# Altium schematic sheet Toradex Carrier Board.SchDoc
size A3; PageSetup: Record=PageOptions|CenterHorizontal=True|CenterVertical=True|PrintScale=0.71|XCorrection=1.00|YCorrection=1.00|PrintKind=0|BorderSize=5000000|LeftOffset=0|BottomOffset=0|Orientation=2|PaperLength=1000|PaperWidth=1000|Scale=100|PaperSource=7|PrintQuality=600|MediaType=1|DitherType=10|PaperKind=A4|PrintScaleMode=1; Date: 27.05.2014; DrawnBy: luths8; Organization: BFH; Address1: Bern University of Applied Sciences; Address2: Engineering and Information Technology; Address3: Jlcoweg 1; Address4: CH-3400 Burgdorf; DocumentNumber: 18; Revision: 1.0; SheetNumber: 5; SheetTotal: 19; CurrentDate: 27.05.2014
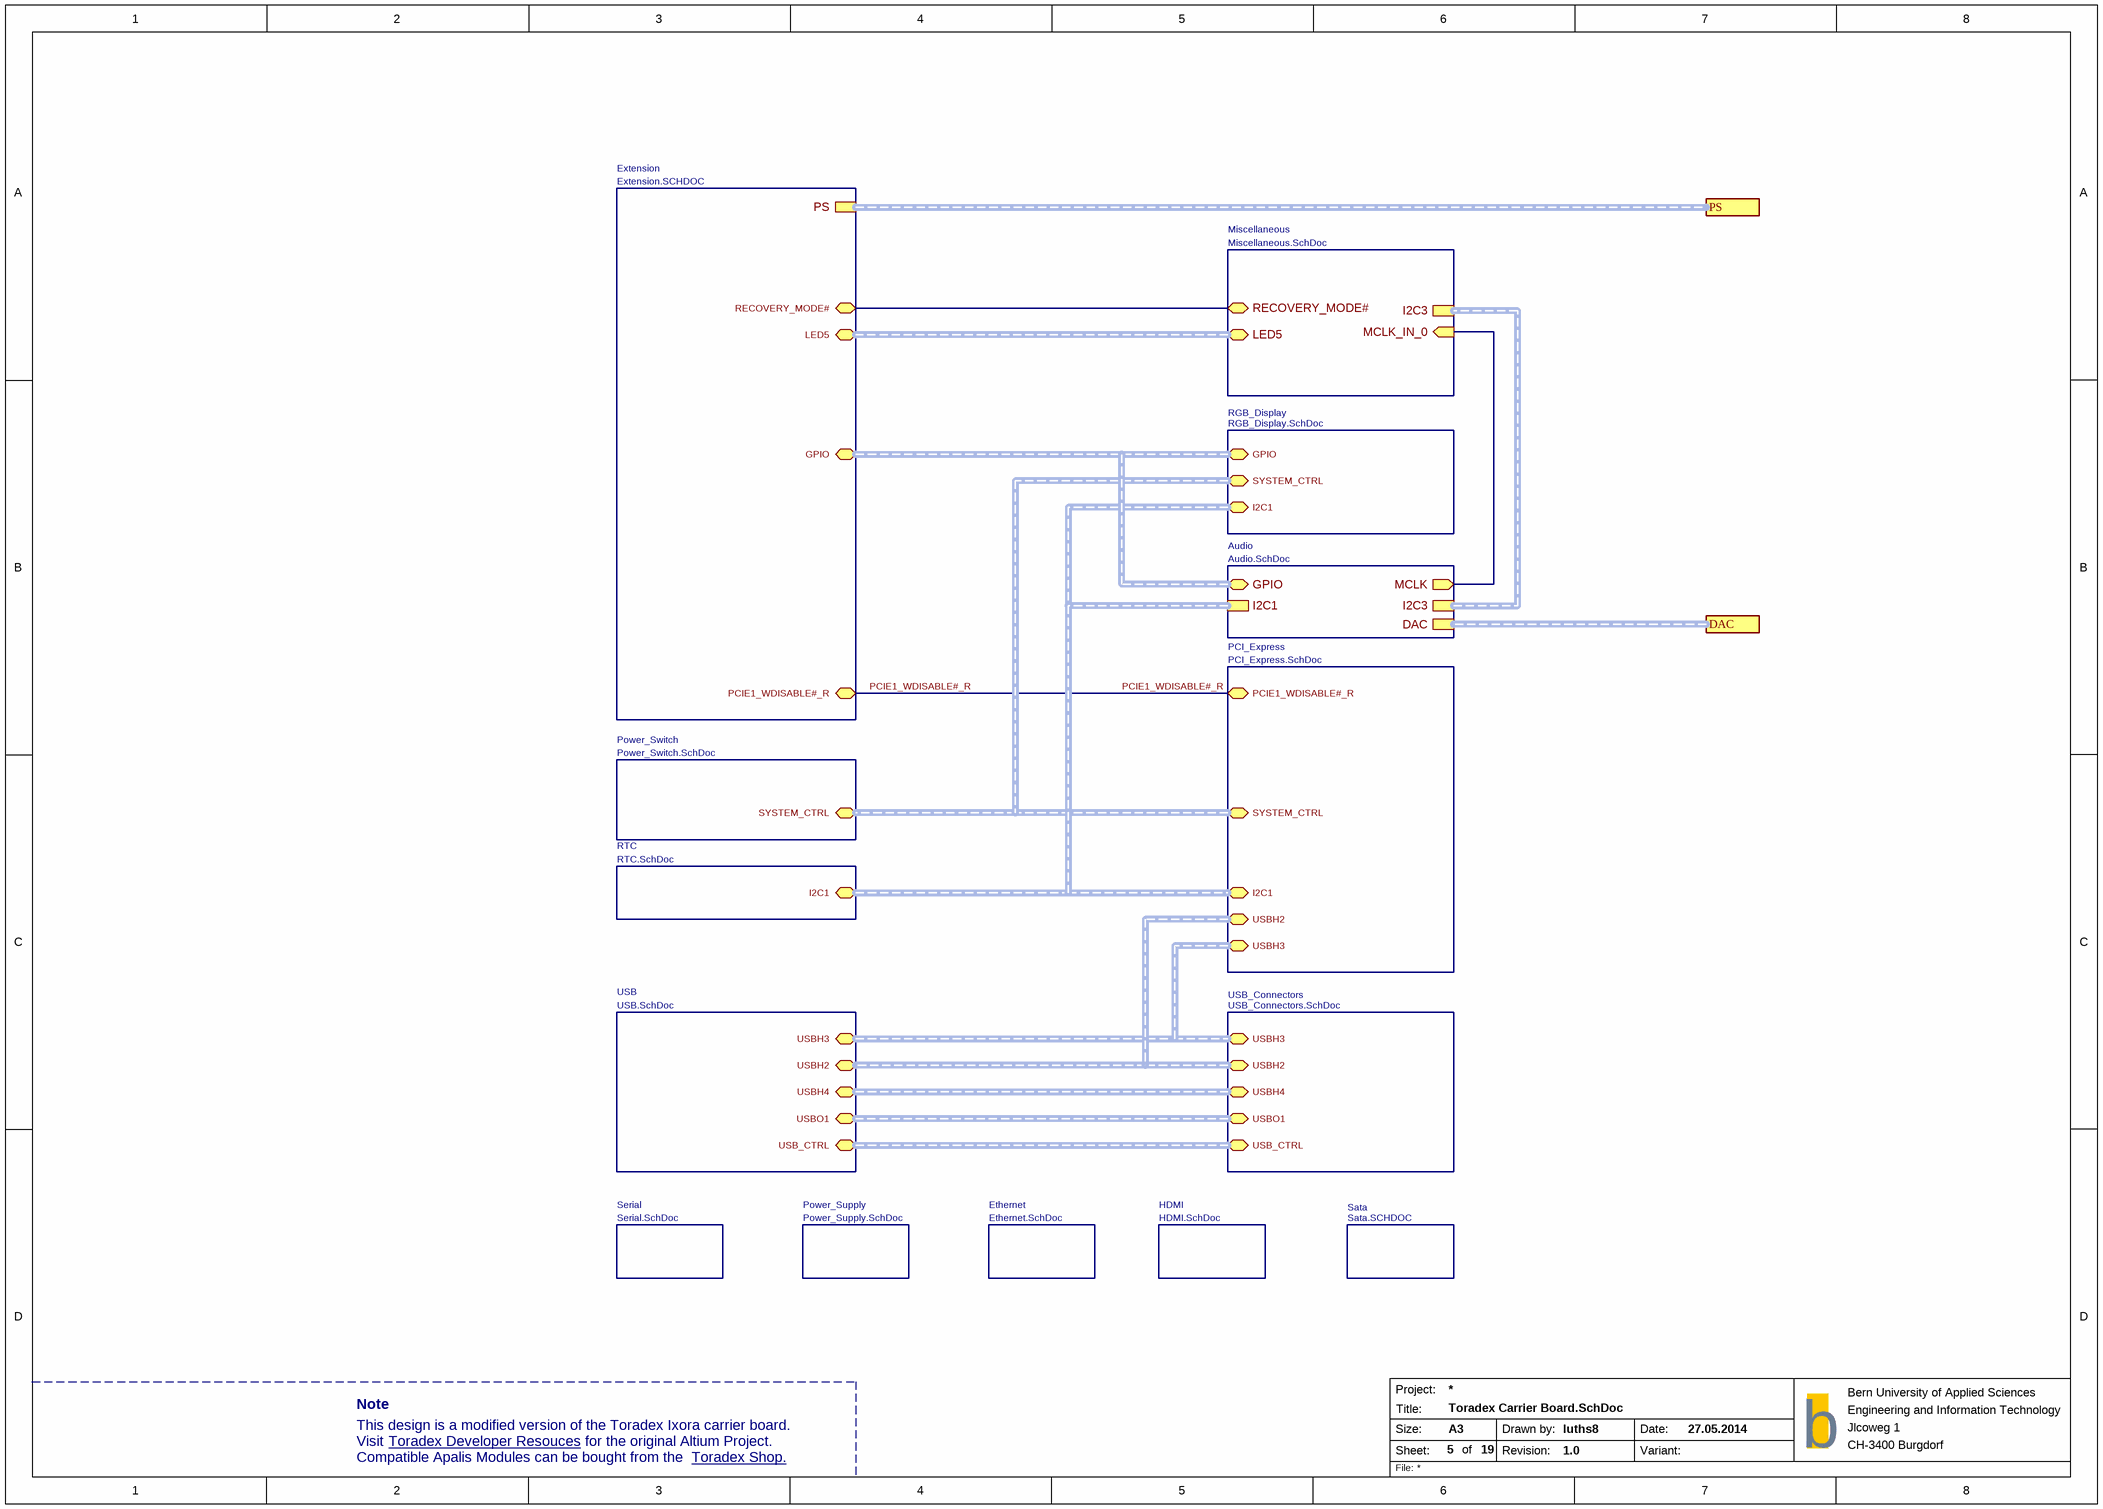
[diagram p0: Toradex Carrier Board.SchDoc]

## Sub-sheets
Audio = Audio.SchDoc: DAC (harness DAC), MCLK (out), I2C3 (harness I2C), I2C1 (harness I2C), GPIO (bidir, harness GPIO)
Ethernet = Ethernet.SchDoc: no entries
Extension = Extension.SCHDOC: GPIO (bidir, harness GPIO), RECOVERY_MODE# (bidir), PCIE1_WDISABLE#_R (bidir), LED5 (bidir, harness LED_5), PS (harness PS)
HDMI = HDMI.SchDoc: no entries
Miscellaneous = Miscellaneous.SchDoc: RECOVERY_MODE# (bidir), LED5 (bidir, harness LED_5), MCLK_IN_0 (in), I2C3 (harness I2C)
PCI_Express = PCI_Express.SchDoc: I2C1 (bidir, harness I2C), USBH2 (bidir), SYSTEM_CTRL (bidir, harness SYS_CTRL), PCIE1_WDISABLE#_R (bidir), USBH3 (bidir)
Power_Supply = Power_Supply.SchDoc: no entries
Power_Switch = Power_Switch.SchDoc: SYSTEM_CTRL (bidir, harness SYS_CTRL)
RGB_Display = RGB_Display.SchDoc: SYSTEM_CTRL (bidir, harness SYS_CTRL), GPIO (bidir, harness GPIO), I2C1 (bidir, harness I2C)
RTC = RTC.SchDoc: I2C1 (bidir, harness I2C)
Sata = Sata.SCHDOC: no entries
Serial = Serial.SchDoc: no entries
USB = USB.SchDoc: USBH2 (bidir, harness USB), USBO1 (bidir, harness USB_SS), USBH4 (bidir, harness USB_SS), USBH3 (bidir, harness USB), USB_CTRL (bidir, harness USB_CTRL)
USB_Connectors = USB_Connectors.SchDoc: USBO1 (bidir), USBH4 (bidir), USBH3 (bidir), USB_CTRL (bidir, harness USB_CTRL), USBH2 (bidir)

## Ports
DAC (harness DAC), PS (harness PS)

## Nets
PCIE1_WDISABLE#_R: sheet PCI_Express/PCIE1_WDISABLE#_R, sheet Extension/PCIE1_WDISABLE#_R
(unnamed): sheet Extension/RECOVERY_MODE#, sheet Miscellaneous/RECOVERY_MODE#
(unnamed): sheet Miscellaneous/MCLK_IN_0, sheet Audio/MCLK

## Buses and harness runs
harness port DAC = sheet Audio/DAC
harness port PS = sheet Extension/PS
harness sheet Audio/GPIO = sheet Extension/GPIO = sheet RGB_Display/GPIO
harness sheet Audio/I2C1 = sheet PCI_Express/I2C1 = sheet RGB_Display/I2C1 = sheet RTC/I2C1
harness sheet Audio/I2C3 = sheet Miscellaneous/I2C3
harness sheet Extension/LED5 = sheet Miscellaneous/LED5
harness sheet PCI_Express/SYSTEM_CTRL = sheet Power_Switch/SYSTEM_CTRL = sheet RGB_Display/SYSTEM_CTRL
harness sheet PCI_Express/USBH2 = sheet USB/USBH2 = sheet USB_Connectors/USBH2
harness sheet PCI_Express/USBH3 = sheet USB/USBH3 = sheet USB_Connectors/USBH3
harness sheet USB/USB_CTRL = sheet USB_Connectors/USB_CTRL
harness sheet USB/USBH4 = sheet USB_Connectors/USBH4
harness sheet USB/USBO1 = sheet USB_Connectors/USBO1

## Notes on the sheet
- Note
- This design is a modified version of the Toradex Ixora carrier board.
- Visit
- Compatible Apalis Modules can be bought from the
- Toradex Developer Resouces <https://developer.toradex.com/products/ixora-carrier-board>
- for the original Altium Project.
- Toradex Shop. <https://www.toradex.com/order-now/apalis-arm-family>
- Project:
- Size:
- Sheet:
- Title:
- A3
- of
- Drawn by:
- Revision:
- Date:
- Variant:
- b
- File: